# Altium project n32-core.PrjPcb
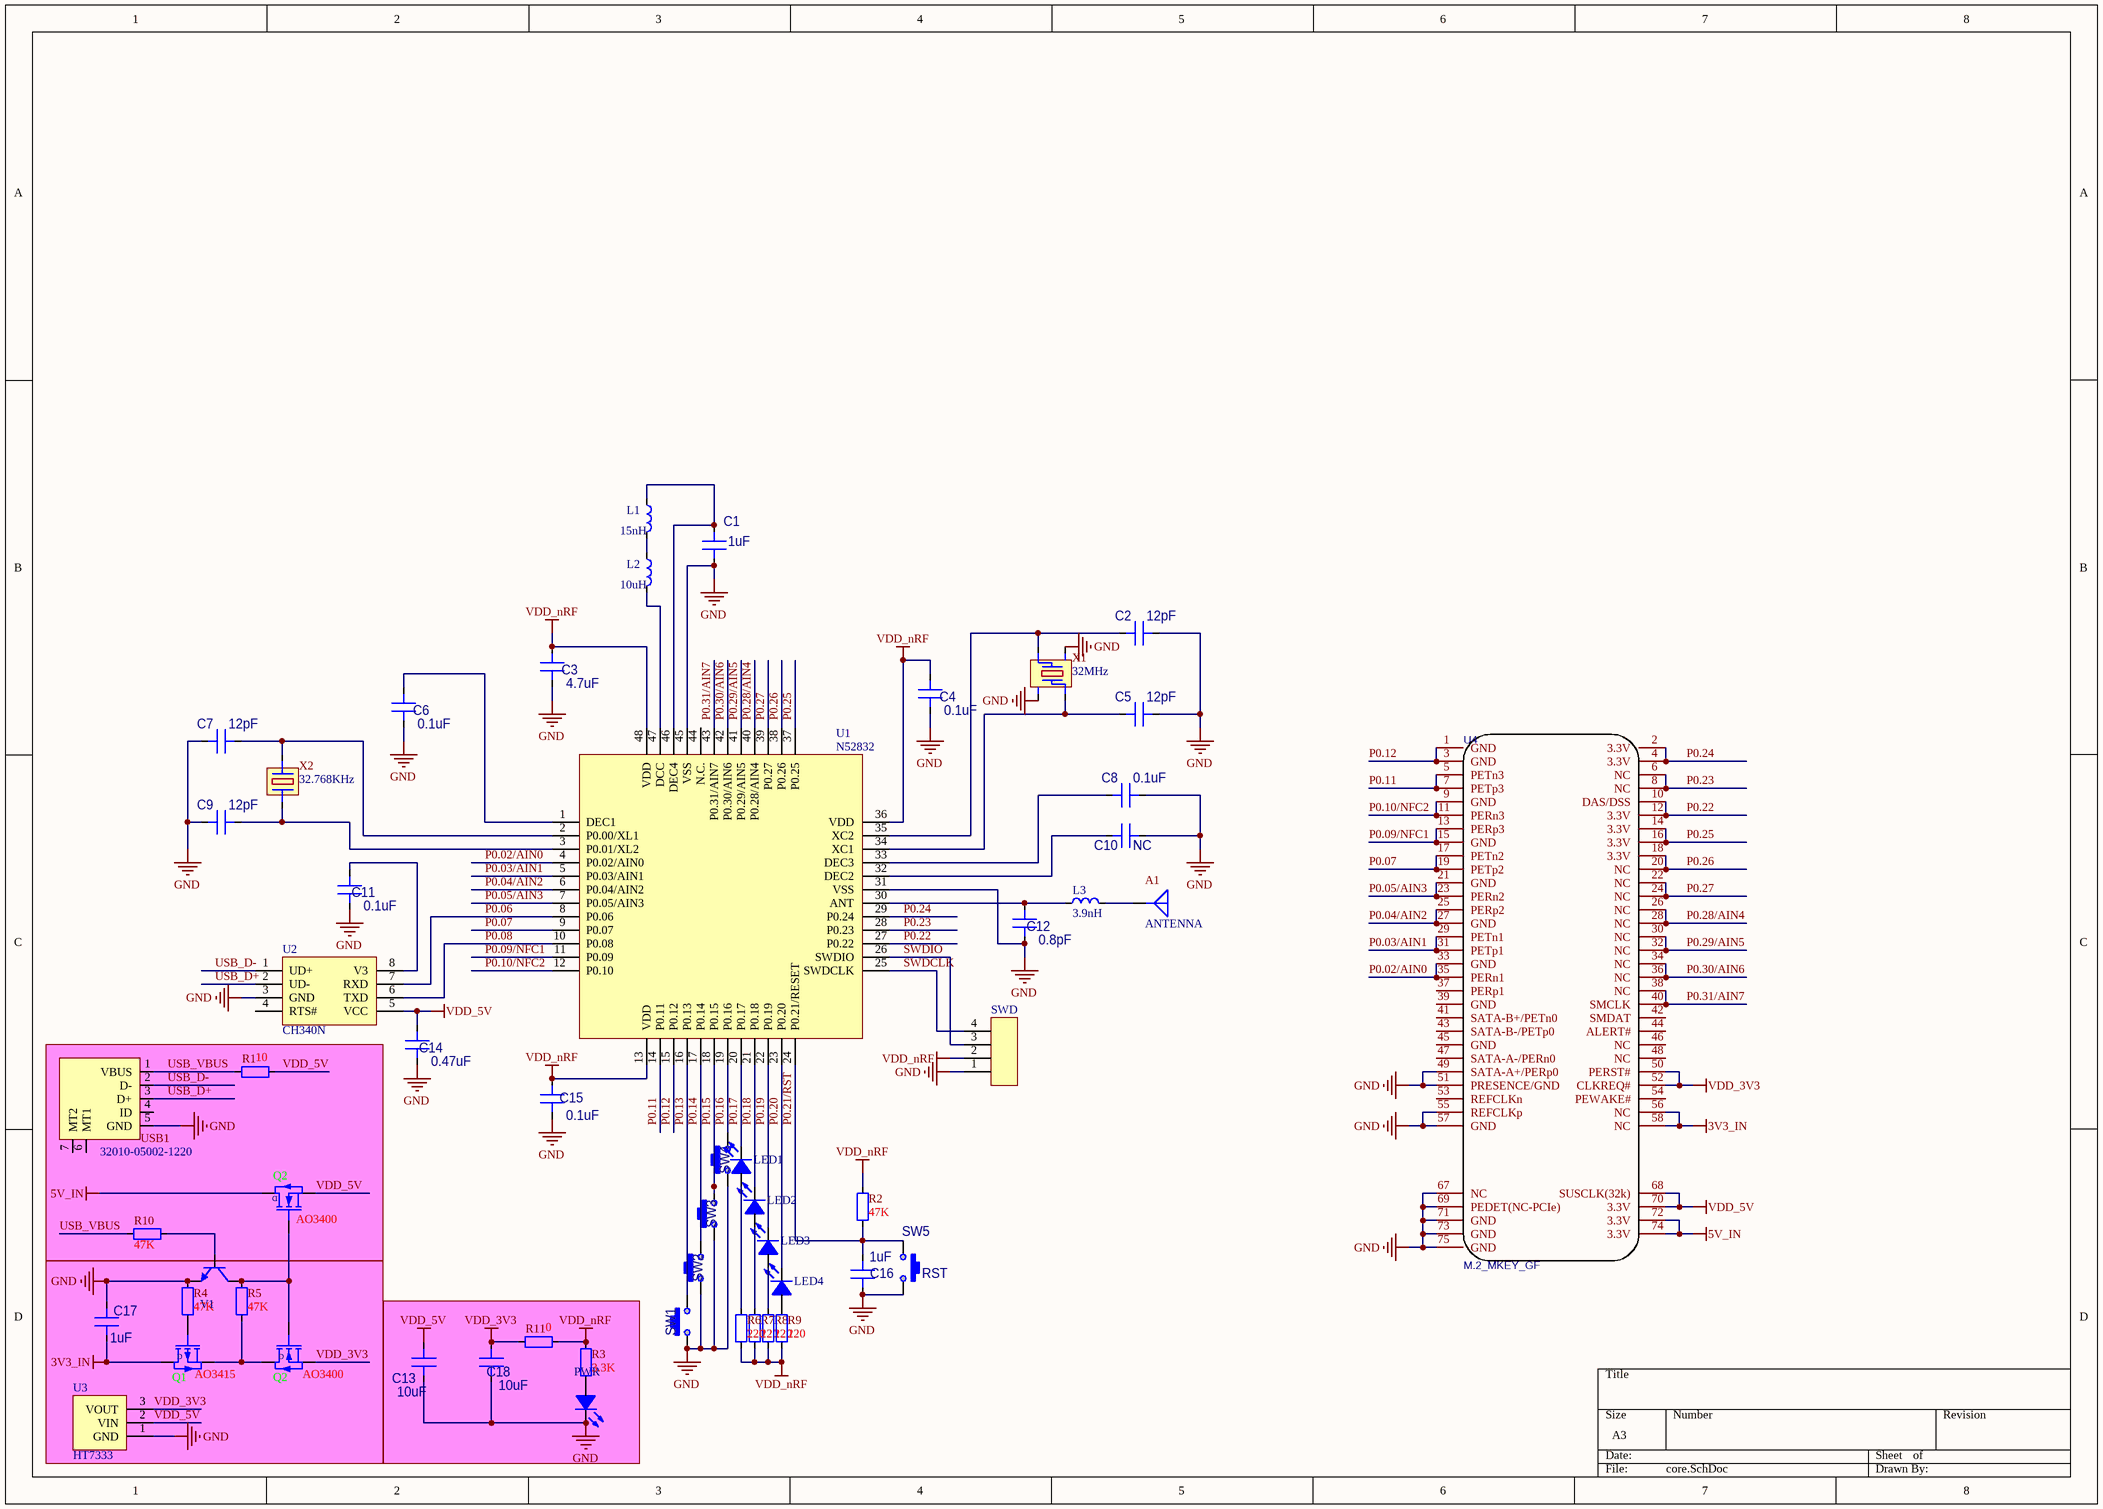
[diagram p0: core.SchDoc]
1 sheet, 55 parts. Net scope: global (net labels, ports and power ports of the same name join across sheets).
Board file: core.PcbDoc

## Sheet core.SchDoc
size A3

### Parts
(Parts that share a designator on the sheet are numbered #1, #2 ... from top to bottom, then left to right.)
A1  ANTENNA  [AN2]
C1  1uF  [cap0603(1608)]
C2  12pF  [cap0603(1608)]
C3  4.7uF  [cap0603(1608)]
C4  0.1uF  [cap0603(1608)]
C5  12pF  [cap0603(1608)]
C6  0.1uF  [cap0603(1608)]
C7  12pF  [cap0603(1608)]
C8  0.1uF  [cap0603(1608)]
C9  12pF  [cap0603(1608)]
C10  NC  [cap0603(1608)]
C11  0.1uF  [cap0603(1608)]
C12  0.8pF  [cap0603(1608)]
C13  10uF  [cap0603(1608)]
C14  0.47uF  [cap0603(1608)]
C15  0.1uF  [cap0603(1608)]
C16  1uF  [cap0603(1608)]
C17  1uF  [cap0603(1608)]
C18  10uF  [cap0603(1608)]
J1  SWD  [HEAD-1x4-2.54-SMD]
L1  15nH  [0603]
L2  10uH  [0603]
L3  3.9nH  [0603]
LED1  LED  [LED-0603-SMD]  (value not drawn)
LED2  LED  [LED-0603-SMD]  (value not drawn)
LED3  LED  [LED-0603-SMD]  (value not drawn)
LED4  LED  [LED-0603-SMD]  (value not drawn)
LED5  PWR  [LED-0603-SMD]
Q1  AO3415  [SOT-23-mosfet]
Q2#1  AO3400  [SOT-23-mosfet]
Q2#2  AO3400  [SOT-23-mosfet]
R1  10  [0603]
R2  47K  [0603]
R3  3.3K  [0603]
R4  47K  [0603]
R5  47K  [0603]
R6  220  [0603]
R7  220  [0603]
R8  220  [0603]
R9  220  [0603]
R10  47K  [0603]
R11  0  [0603]
SW1  SW-2P  [SW_2PIN_3x6]  (value not drawn)
SW2  SW-2P  [SW_2PIN_3x6]  (value not drawn)
SW3  SW-2P  [SW_2PIN_3x6]  (value not drawn)
SW4  SW-2P  [SW_2PIN_3x6]  (value not drawn)
SW5  RST  [SW_2PIN_3x6]
U1  N52832  [N52832-QFN48]
U2  CH340N  [CH340N]
U3  HT7333  [HT7333-SOT-89]
U4  M.2_MKEY_GF  [M.2_M_KEY_GF]
USB1  32010-05002-1220  [MICRO USB]
V1  NPN  [SOT-23-NPN]  (value not drawn)
X1  32MHz  [X3225-4PIN]
X2  32.768KHz  [32.768_A]

### Nets
3V3_IN: C17.1 Q1.D U4.56(NC) U4.58(NC)
5V_IN: Q2#1.D U4.72(3.3V) U4.74(3.3V)
GND: C1.2 C2.2 C3.2 C4.2 C5.2 C6.2 C7.1 C8.2 C9.1 C10.2 C11.2 C12.2 C13.2 C14.2 C15.2 C16.2 C17.2 C18.2 J1.1 LED5.2(K) R4.1 SW1.1 SW2.1 SW3.1 SW4.1 SW5.2 U1.31(VSS) U1.45(VSS) U2.3(GND) U3.1(GND) U4.49(SATA-A+/PERp0) U4.51(PRESENCE/GND) U4.55(REFCLKp) U4.57(GND) U4.67(NC) U4.69(PEDET(NC-PCIe)) U4.71(GND) U4.73(GND) U4.75(GND) USB1.5(GND) V1.E X1.2(nc) X1.4(nc)
VDD_3V3: C18.1 Q2#2.S R11.1 U3.3(VOUT) U4.50(PERST#) U4.52(CLKREQ#)
VDD_5V: C13.1 C14.1 Q2#1.S R1.1 U2.5(VCC) U3.2(VIN) U4.68(SUSCLK(32k)) U4.70(3.3V)
VDD_nRF: C3.1 C4.1 C15.1 J1.2 R2.2 R3.2 R6.1 R7.1 R8.1 R9.1 R11.2 U1.13(VDD) U1.36(VDD) U1.48(VDD)
P0.02/AIN0: U1.4(P0.02/AIN0) U4.33(GND) U4.35(PERn1)
P0.03/AIN1: U1.5(P0.03/AIN1) U4.29(PETn1) U4.31(PETp1)
P0.04/AIN2: U1.6(P0.04/AIN2) U4.25(PERp2) U4.27(GND)
P0.05/AIN3: U1.7(P0.05/AIN3) U4.21(GND) U4.23(PERn2)
P0.06: U1.8(P0.06) U2.7(RXD)
P0.07: U1.9(P0.07) U4.17(PETn2) U4.19(PETp2)
P0.08: U1.10(P0.08) U2.6(TXD)
P0.09/NFC1: U1.11(P0.09) U4.13(PERp3) U4.15(GND)
P0.10/NFC2: U1.12(P0.10) U4.9(GND) U4.11(PERn3)
P0.11: U1.14(P0.11) U4.5(PETn3) U4.7(PETp3)
P0.12: U1.15(P0.12) U4.1(GND) U4.3(GND)
P0.13: SW1.2 U1.16(P0.13)
P0.14: SW2.2 U1.17(P0.14)
P0.15: SW3.2 U1.18(P0.15)
P0.16: SW4.2 U1.19(P0.16)
P0.17: LED1.2(K) U1.20(P0.17)
P0.18: LED2.2(K) U1.21(P0.18)
P0.19: LED3.2(K) U1.22(P0.19)
P0.20: LED4.2(K) U1.23(P0.20)
P0.21/RST: C16.1 R2.1 SW5.1 U1.24(P0.21/RESET)
P0.22: U1.27(P0.22) U4.10(DAS/DSS) U4.12(3.3V)
P0.23: U1.28(P0.23) U4.6(NC) U4.8(NC)
P0.24: U1.29(P0.24) U4.2(3.3V) U4.4(3.3V)
P0.25: U1.37(P0.25) U4.14(3.3V) U4.16(3.3V)
P0.26: U1.38(P0.26) U4.18(3.3V) U4.20(NC)
P0.27: U1.39(P0.27) U4.22(NC) U4.24(NC)
P0.28/AIN4: U1.40(P0.28/AIN4) U4.26(NC) U4.28(NC)
P0.29/AIN5: U1.41(P0.29/AIN5) U4.30(NC) U4.32(NC)
P0.30/AIN6: U1.42(P0.30/AIN6) U4.34(NC) U4.36(NC)
P0.31/AIN7: U1.43(P0.31/AIN7) U4.38(NC) U4.40(SMCLK)
SWDCLK: J1.4 U1.25(SWDCLK)
SWDIO: J1.3 U1.26(SWDIO)
USB_D+: U2.2(UD-) USB1.3(D+)
USB_D-: U2.1(UD+) USB1.2(D-)
USB_VBUS: R1.2 R10.2 USB1.1(VBUS)
NetA1_1: A1.1(A) L3.2
NetC1_1: C1.1 L1.1 U1.46(DEC4)
NetC2_1: C2.1 U1.35(XC2) X1.3(OUT)
NetC5_1: C5.1 U1.34(XC1) X1.1(IN)
NetC6_1: C6.1 U1.1(DEC1)
NetC7_2: C7.2 U1.2(P0.00/XL1) X2.2(OUT)
NetC8_1: C8.1 U1.33(DEC3)
NetC9_2: C9.2 U1.3(P0.01/XL2) X2.1(IN)
NetC10_1: C10.1 U1.32(DEC2)
NetC11_1: C11.1 U2.8(V3)
NetC12_1: C12.1 L3.1 U1.30(ANT)
NetL1_2: L1.2 L2.1
NetL2_2: L2.2 U1.47(DCC)
NetLED1_1: LED1.1(A) R6.2
NetLED2_1: LED2.1(A) R7.2
NetLED3_1: LED3.1(A) R8.2
NetLED4_1: LED4.1(A) R9.2
NetLED5_1: LED5.1(A) R3.1
NetQ1_G: Q1.G R4.2
NetQ1_S: Q1.S Q2#2.D R5.2
NetQ2#1_G: Q2#1.G Q2#2.G R5.1 V1.C
NetR10_1: R10.1 V1.B

Not connected (* = marked no-connect by the designer): U1 44(N.C.); U2 4(RTS#); U4 37(PERp1) 39(GND) 41(SATA-B+/PETn0) 42(SMDAT) 43(SATA-B-/PETp0) 44(ALERT#) 45(GND) 46(NC) 47(SATA-A-/PERn0) 48(NC) 53(REFCLKn) 54(PEWAKE#); USB1 4(ID) 6(MT1) 7(MT2)

### Library data of the parts
A1 = ANTENNA: PCB Antenna
C1-C18 = CAP
J1 = HEAD-1x4
L1-L3 = L
LED5 = LED
Q1 = MOSFET-P
Q2#1 Q2#2 = MOSFET-N
R1-R11 = R
SW5 = SW-2P
U1 = NRF52832
U4 = M.2_MKEY_GF(gold_finger): BOM_Manufacturer: SHOWNAME=F; Contributor: redgragon; BOM_Manufacturer Part: SHOWNAME=F; BOM_Supplier Part: SHOWNAME=F; BOM_Supplier: SHOWNAME=F; link: SHOWNAME=F; spicePre: U; spiceSymbolName: GF_M.2_MKEY
USB1 = Micro_USB: Micro_USB_5S_B
X1 = Crystal_4PIN
X2 = Crystal_2PIN